# Altium schematic sheet MCU.SchDoc
size A3
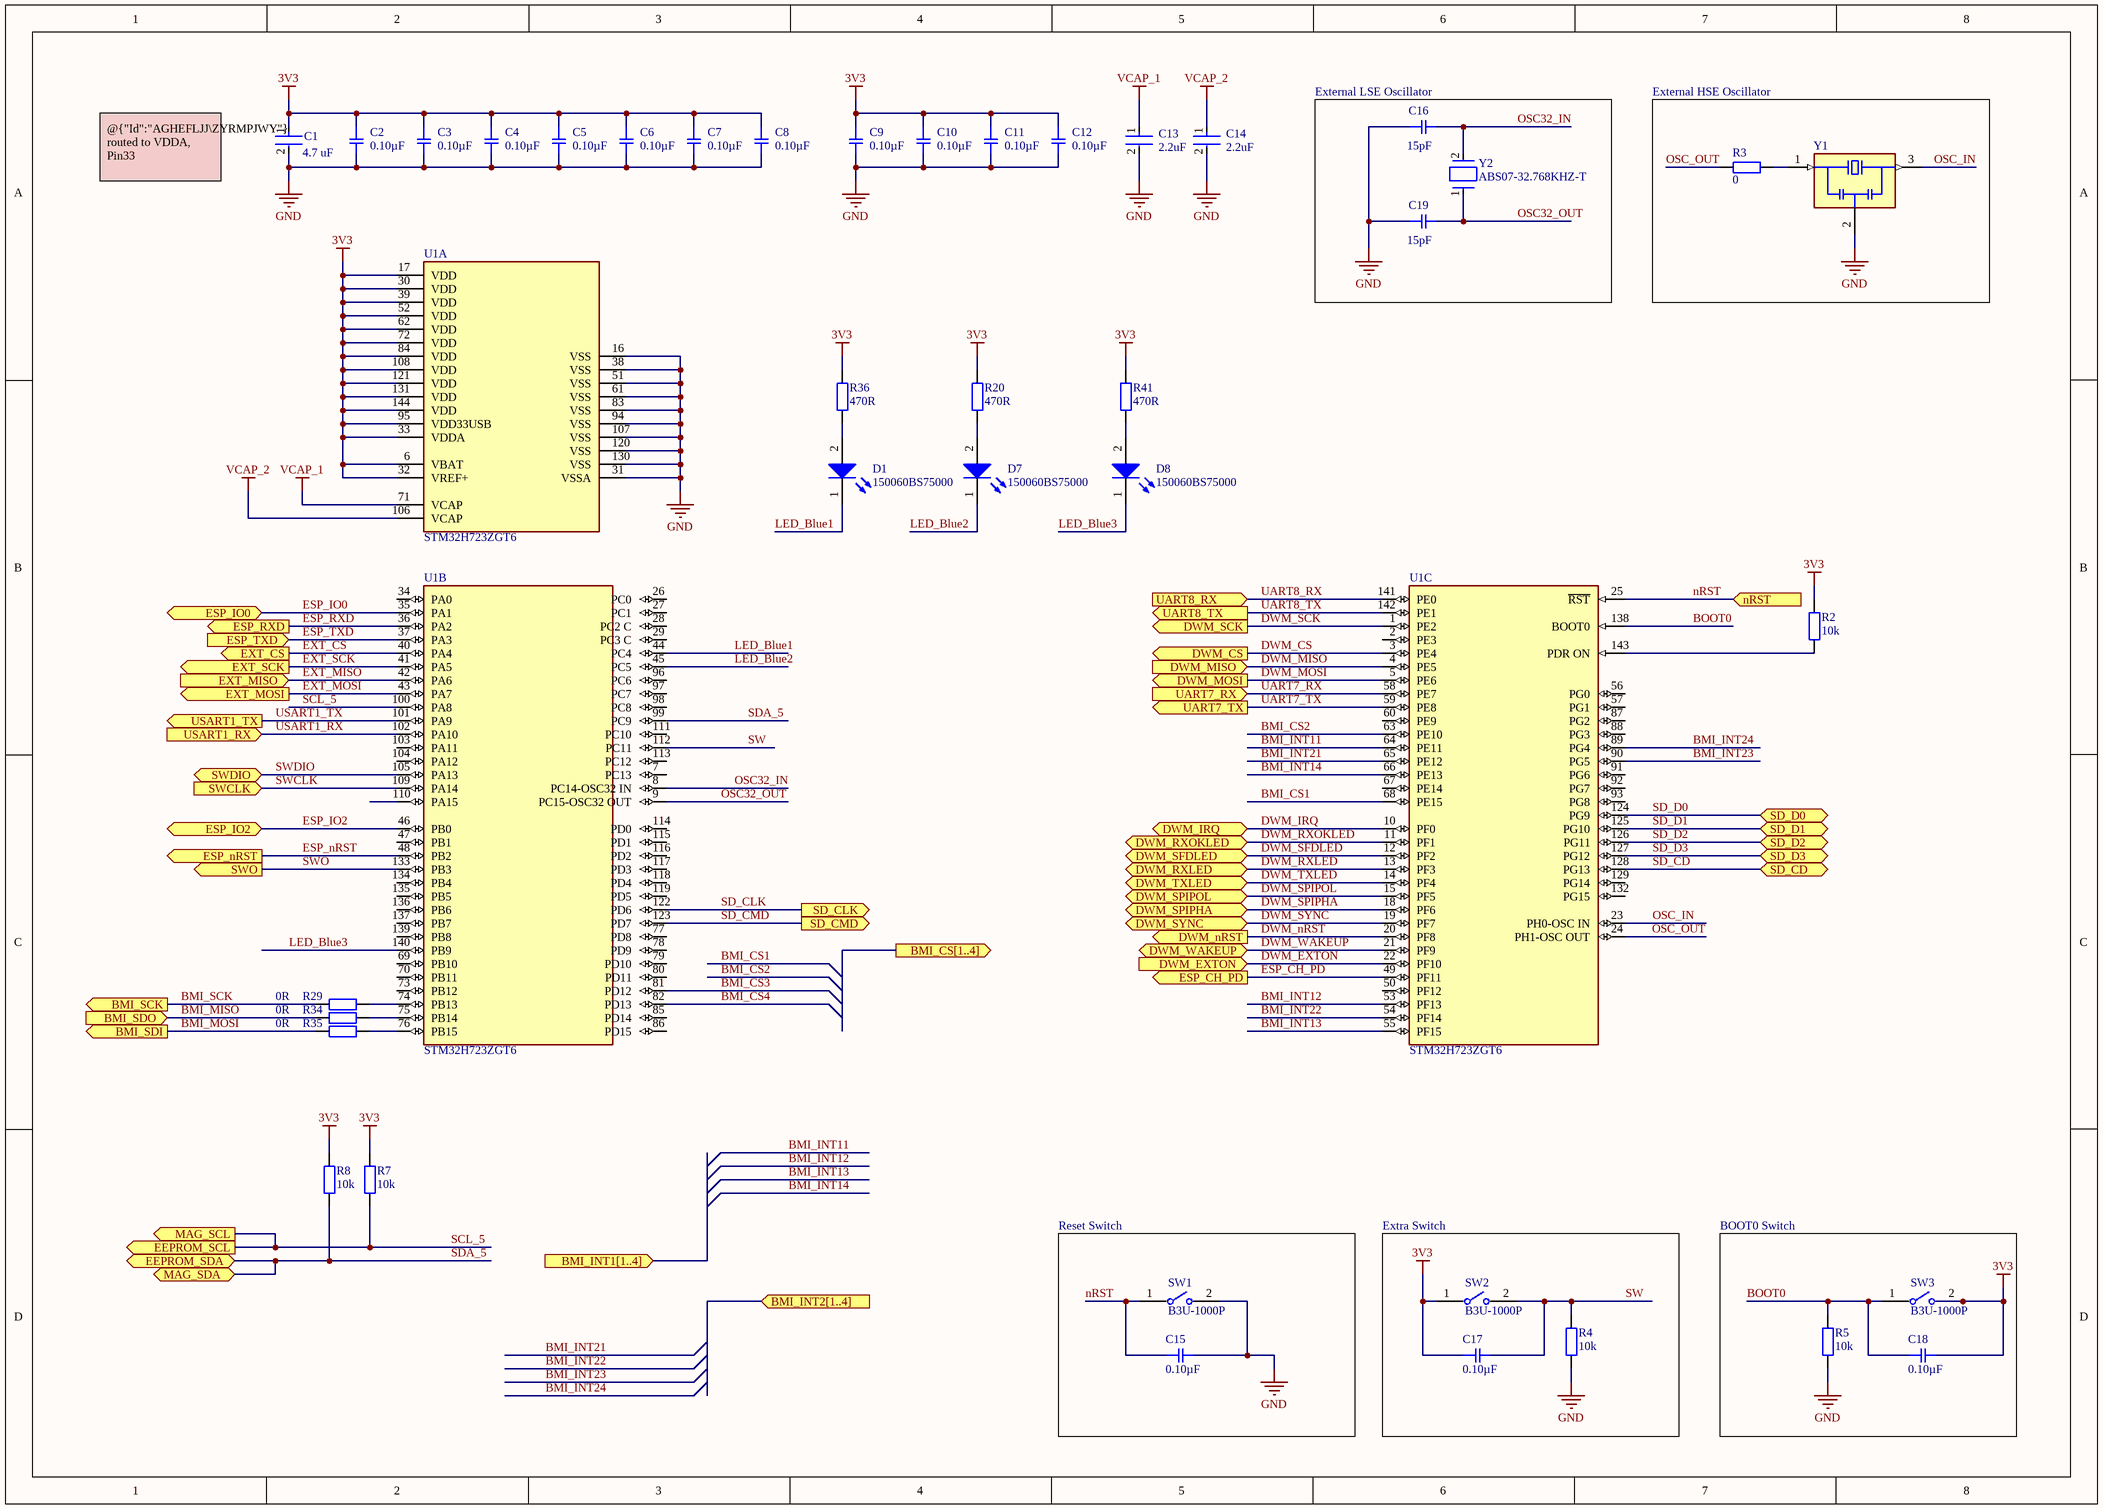
[diagram p0: MCU.SchDoc]

## Parts
C1  value 4.7 uF  [FP-CC0805-0_85-MFG]  (hidden comment: CC0805KKX7R8BB475)
C2  value 0.10µF  [SMD-0402C]  (hidden comment: GRM155R61A104KA01J)
C3  value 0.10µF  [SMD-0402C]  (hidden comment: GRM155R61A104KA01J)
C4  value 0.10µF  [SMD-0402C]  (hidden comment: GRM155R61A104KA01J)
C5  value 0.10µF  [SMD-0402C]  (hidden comment: GRM155R61A104KA01J)
C6  value 0.10µF  [SMD-0402C]  (hidden comment: GRM155R61A104KA01J)
C7  value 0.10µF  [SMD-0402C]  (hidden comment: GRM155R61A104KA01J)
C8  value 0.10µF  [SMD-0402C]  (hidden comment: GRM155R61A104KA01J)
C9  value 0.10µF  [SMD-0402C]  (hidden comment: GRM155R61A104KA01J)
C10  value 0.10µF  [SMD-0402C]  (hidden comment: GRM155R61A104KA01J)
C11  value 0.10µF  [SMD-0402C]  (hidden comment: GRM155R61A104KA01J)
C12  value 0.10µF  [SMD-0402C]  (hidden comment: GRM155R61A104KA01J)
C13  Capacitance: 2.2uF  [FP-GRM21B-0_15-IPC_A]  (hidden comment: GRM21BR71E225KE11L)
C14  Capacitance: 2.2uF  [FP-GRM21B-0_15-IPC_A]  (hidden comment: GRM21BR71E225KE11L)
C15  value 0.10µF  [SMD-0402C]  (hidden comment: GRM155R61A104KA01J)
C16  value 15pF  [SMD-0402C]  (hidden comment: GRM1555C1H150FA01D)
C17  value 0.10µF  [SMD-0402C]  (hidden comment: GRM155R61A104KA01J)
C18  value 0.10µF  [SMD-0402C]  (hidden comment: GRM155R61A104KA01J)
C19  value 15pF  [SMD-0402C]  (hidden comment: GRM1555C1H150FA01D)
D1  150060BS75000  [WL-SMCW_0603_150060xx75000]
D7  150060BS75000  [WL-SMCW_0603_150060xx75000]
D8  150060BS75000  [WL-SMCW_0603_150060xx75000]
R2  10k  [IPC C R0402 NO SILK]
R3  value 0  [IPC C R0402 NO SILK]  (hidden comment: 0R)
R4  10k  [IPC C R0402 NO SILK]
R5  10k  [IPC C R0402 NO SILK]
R7  10k  [IPC C R0402 NO SILK]
R8  10k  [IPC C R0402 NO SILK]
R20  470R  [IPC C R0402 NO SILK]
R29  0R  [IPC C R0402 NO SILK]
R34  0R  [IPC C R0402 NO SILK]
R35  0R  [IPC C R0402 NO SILK]
R36  470R  [IPC C R0402 NO SILK]
R41  470R  [IPC C R0402 NO SILK]
SW1  B3U-1000P  [FP-B3U-1000P-MFG]
SW2  B3U-1000P  [FP-B3U-1000P-MFG]
SW3  B3U-1000P  [FP-B3U-1000P-MFG]
U1  STM32H723ZGT6  [FP-LQFP144-1A-IPC_A]  (parts A,B,C of 3)
Y1  CSTNE8M00G550000R0  [OSC_CSTNE8M00G550000R0]  (value not drawn)
Y2  ABS07-32.768KHZ-T  [FP-ABS07-MFG]

## Blocks framed on the sheet
External LSE Oscillator: C16 C19 Y2
External HSE Oscillator: R3 Y1
Reset Switch: C15 SW1
Extra Switch: C17 R4 SW2
BOOT0 Switch: C18 R5 SW3

## Ports
BMI_CS[1..4] (out), BMI_INT1[1..4] (in), BMI_INT2[1..4] (in), BMI_SCK (out), BMI_SDI (out), BMI_SDO (in), DWM_CS (out), DWM_EXTON (in), DWM_IRQ (bidir), DWM_MISO (in), DWM_MOSI (out), DWM_nRST (out), DWM_RXLED (bidir), DWM_RXOKLED (bidir), DWM_SCK (out), DWM_SFDLED (bidir), DWM_SPIPHA (bidir), DWM_SPIPOL (bidir), DWM_SYNC (bidir), DWM_TXLED (bidir), DWM_WAKEUP (bidir), EEPROM_SCL (out), EEPROM_SDA (bidir), ESP_CH_PD (out), ESP_IO0 (bidir), ESP_IO2 (bidir), ESP_nRST (out), ESP_RXD (out), ESP_TXD (in), EXT_CS (out), EXT_MISO (in), EXT_MOSI (out), EXT_SCK (out), MAG_SCL (out), MAG_SDA (bidir), nRST (in), SD_CD (bidir), SD_CLK (out), SD_CMD (out), SD_D0 (bidir), SD_D1 (bidir), SD_D2 (bidir), SD_D3 (bidir), SWCLK (in), SWDIO (bidir), SWO (out), UART7_RX (in), UART7_TX (out), UART8_RX (in), UART8_TX (out), USART1_RX (in), USART1_TX (out)

## Nets
3V3: C1.1 C2.1 C3.1 C4.1 C5.1 C6.1 C7.1 C8.1 C9.1 C10.1 C11.1 C12.1 C17.1 C18.2 R2.1 R7.1 R8.1 R20.2 R36.2 R41.2 SW2.1 SW3.2 U1.6(VBAT) U1.17(VDD) U1.30(VDD) U1.32(VREF+) U1.33(VDDA) U1.39(VDD) U1.52(VDD) U1.62(VDD) U1.72(VDD) U1.84(VDD) U1.95(VDD33USB) U1.108(VDD) U1.121(VDD) U1.131(VDD) U1.144(VDD)
GND: C1.2 C2.2 C3.2 C4.2 C5.2 C6.2 C7.2 C8.2 C9.2 C10.2 C11.2 C12.2 C13.2 C14.2 C15.2 C16.1 C19.1 R4.1 R5.1 SW1.2 U1.16(VSS) U1.31(VSSA) U1.38(VSS) U1.51(VSS) U1.61(VSS) U1.83(VSS) U1.94(VSS) U1.107(VSS) U1.120(VSS) U1.130(VSS) Y1.2(GND)
VCAP_1: C13.1 U1.71(VCAP)
VCAP_2: C14.1 U1.106(VCAP)
BMI_CS1: U1.68(PE15)
BMI_CS2: U1.63(PE10)
BMI_CS3: U1.81(PD12)
BMI_CS4: U1.82(PD13)
BMI_INT11: U1.64(PE11)
BMI_INT12: U1.53(PF13)
BMI_INT13: U1.55(PF15)
BMI_INT14: U1.66(PE13)
BMI_INT21: U1.65(PE12)
BMI_INT22: U1.54(PF14)
BMI_INT23: U1.90(PG5)
BMI_INT24: U1.89(PG4)
BMI_MISO: R34.1 ; port BMI_SDO
BMI_MOSI: R35.1 ; port BMI_SDI
BMI_SCK: R29.1 ; port BMI_SCK
BOOT0: C18.1 R5.2 SW3.1 U1.138(BOOT0)
DWM_CS: U1.3(PE4) ; port DWM_CS
DWM_EXTON: U1.22(PF10) ; port DWM_EXTON
DWM_IRQ: U1.10(PF0) ; port DWM_IRQ
DWM_MISO: U1.4(PE5) ; port DWM_MISO
DWM_MOSI: U1.5(PE6) ; port DWM_MOSI
DWM_nRST: U1.20(PF8) ; port DWM_nRST
DWM_RXLED: U1.13(PF3) ; port DWM_RXLED
DWM_RXOKLED: U1.11(PF1) ; port DWM_RXOKLED
DWM_SCK: U1.1(PE2) ; port DWM_SCK
DWM_SFDLED: U1.12(PF2) ; port DWM_SFDLED
DWM_SPIPHA: U1.18(PF6) ; port DWM_SPIPHA
DWM_SPIPOL: U1.15(PF5) ; port DWM_SPIPOL
DWM_SYNC: U1.19(PF7) ; port DWM_SYNC
DWM_TXLED: U1.14(PF4) ; port DWM_TXLED
DWM_WAKEUP: U1.21(PF9) ; port DWM_WAKEUP
ESP_CH_PD: U1.49(PF11) ; port ESP_CH_PD
ESP_IO0: U1.35(PA1) ; port ESP_IO0
ESP_IO2: U1.46(PB0) ; port ESP_IO2
ESP_nRST: U1.48(PB2) ; port ESP_nRST
ESP_RXD: U1.36(PA2) ; port ESP_RXD
ESP_TXD: U1.37(PA3) ; port ESP_TXD
EXT_CS: U1.40(PA4) ; port EXT_CS
EXT_MISO: U1.42(PA6) ; port EXT_MISO
EXT_MOSI: U1.43(PA7) ; port EXT_MOSI
EXT_SCK: U1.41(PA5) ; port EXT_SCK
LED_Blue1: D1.1(K) U1.44(PC4)
LED_Blue2: D7.1(K) U1.45(PC5)
LED_Blue3: D8.1(K) U1.140(PB9)
nRST: C15.1 SW1.1 U1.25(~{RST}) ; port nRST
OSC32_IN: C16.2 U1.8(PC14-OSC32_IN) Y2.2
OSC32_OUT: C19.2 U1.9(PC15-OSC32_OUT) Y2.1
OSC_IN: U1.23(PH0-OSC_IN) Y1.3(OUT)
OSC_OUT: R3.2 U1.24(PH1-OSC_OUT)
SCL_5: R7.2 U1.100(PA8) ; port EEPROM_SCL, port MAG_SCL
SD_CD: U1.128(PG13) ; port SD_CD
SD_CLK: U1.122(PD6) ; port SD_CLK
SD_CMD: U1.123(PD7) ; port SD_CMD
SD_D0: U1.124(PG9) ; port SD_D0
SD_D1: U1.125(PG10) ; port SD_D1
SD_D2: U1.126(PG11) ; port SD_D2
SD_D3: U1.127(PG12) ; port SD_D3
SDA_5: R8.2 U1.99(PC9) ; port EEPROM_SDA, port MAG_SDA
SW: C17.2 R4.2 SW2.2 U1.112(PC11)
SWCLK: U1.109(PA14) ; port SWCLK
SWDIO: U1.105(PA13) ; port SWDIO
SWO: U1.133(PB3) ; port SWO
UART7_RX: U1.58(PE7) ; port UART7_RX
UART7_TX: U1.59(PE8) ; port UART7_TX
UART8_RX: U1.141(PE0) ; port UART8_RX
UART8_TX: U1.142(PE1) ; port UART8_TX
USART1_RX: U1.102(PA10) ; port USART1_RX
USART1_TX: U1.101(PA9) ; port USART1_TX
NetD1_2: D1.2(A) R36.1
NetD7_2: D7.2(A) R20.1
NetD8_2: D8.2(A) R41.1
NetR2_2: R2.2 U1.143(PDR_ON)
NetR3_1: R3.1 Y1.1(IN)
NetR29_2: R29.2 U1.74(PB13)
NetR34_2: R34.2 U1.75(PB14)
NetR35_2: R35.2 U1.76(PB15)

Not connected (* = marked no-connect by the designer): U1 2(PE3) 7(PC13) 26(PC0) 27(PC1) 28(PC2_C) 29(PC3_C) 34(PA0) 47(PB1) 50(PF12) 56(PG0) 57(PG1) 60(PE9) 67(PE14) 69(PB10) 70(PB11) 73(PB12) 77(PD8) 78(PD9) 79(PD10) 80(PD11) 85(PD14) 86(PD15) 87(PG2) 88(PG3) 91(PG6) 92(PG7) 93(PG8) 96(PC6) 97(PC7) 98(PC8) 103(PA11) 104(PA12) 110(PA15) 111(PC10) 113(PC12) 114(PD0) 115(PD1) 116(PD2) 117(PD3) 118(PD4) 119(PD5) 129(PG14) 132(PG15) 134(PB4) 135(PB5) 136(PB6) 137(PB7) 139(PB8)

## Notes on the sheet
- @{"Id":"AGHEFLJJ\ZYRMPJWY"} routed to VDDA, Pin33

## Library data of the parts
C1 = CMP-03422-000306-1: CAP CER 4.7UF 25V X7R 0805; Manufacturer: Yageo; Material: Ceramic; Tolerance: 0.1; ComponentLink2Description: Datasheet; Footprint Url: http://www.yageo.com/exep/pages/download/literatures/UPY-C_GEN_24.pdf; Temperature Range High: +85°C; Package: CC0805-0.85; Octopart: https://octopart.com/cc0805kkx7r8bb475-yageo-51849247; Mouser Description: Multilayer Ceramic Capacitors MLCC - SMD/SMT 4.7M pF 10% 25 Volts; Capacitance: 4.7 uF; Ipc Land Pattern Name: CAPC200125X85; Temperature: -30°C to +85°C; Digikey Description: CAP CER 4.7UF 25V X7R 0805; Temperature Characteristic: X7R; Temperature Range Low: -30°C; Lead Free: Yes; RoHS: TRUE; Device Class L3: Ceramic Capacitors; ComponentLink2URL: http://www.yageo.com/documents/recent/UPY-GPHC_Y5V_6.3V-to-50V_8.pdf; Category: Cap; Device Class L2: Capacitors; Manufacturer Part Number: CC0805KKX7R8BB475; Device Class L1: Passive Components; Height: 0.95mm; Automotive: No; Voltage Rating: 25 V
C2-C12 C15 C17 C18 = CMP-140-000687-1: CAP CER 0.1UF 10V X5R 0402; Manufacturer: Murata Electronics North America; Factory Stock: 0; Unit Price (USD): 0.1; Minimum Quantity: 1; Tolerance: ±10%; Ratings: -; Lead Spacing: -; Source: capacitor_murata_0402$.SchLib; Part Status: Active; Pin Count: 2; Digi-Key Part Number: 490-6297-1-ND; Operating Temperature: -55°C ~ 85°C; Height - Seated (Max): -; Voltage: 10V; @ qty: 0; Temperature Coefficient: X5R; Package / Case: 0402 (1005 Metric); Size / Dimension: 0.039" L x 0.020" W (1.00mm x 0.50mm); Quantity Available: 24406; Datasheets: http://www.murata.com/~/media/webrenewal/support/library/catalog/products/capacitor/mlcc/c02e.pdf; Series: GRM; Applications: General Purpose; Thickness (Max): 0.022" (0.55mm); Image: //media.digikey.com/Renders/Murata%20Renders/ZRB-SERIES-0402.jpg; Packaging: Cut Tape (CT); Part Number: GRM155R61A104KA01J; Features: -; Component Type: Standard; Mounting Type: Surface Mount, MLCC; Design Item ID: GRM155R61A104KA01J
C13 C14 = CMP-06035-028354-1: Chip Multilayer Ceramic Capacitors for General Purpose, 0805, 2.2uF, X7R, 15%, 10%, 25V; Voltage Rating (DC): 25V; Thickness: 1.25mm; Dielectric: X7R; Tolerance: 10%; Length: 2mm; Width: 1.25mm
C16 C19 = CMP-140-000297-1: CAP CER 15PF 50V NP0 0402; Manufacturer: Murata Electronics North America; Minimum Quantity: 1; Factory Stock: 0; Tolerance: ±1%; Unit Price (USD): 0.1; Temperature Coefficient: C0G, NP0; Component Type: Standard; Features: -; Part Status: Active; Thickness (Max): 0.022" (0.55mm); Quantity Available: 187310; Design Item ID: GRM1555C1H150FA01D; Datasheets: http://www.murata.com/~/media/webrenewal/support/library/catalog/products/capacitor/mlcc/c02e.pdf; Image: //media.digikey.com/Renders/Murata%20Renders/ZRB-SERIES-0402.jpg; Applications: General Purpose; Packaging: Cut Tape (CT); Height - Seated (Max): -; Source: capacitor_murata_0402$.SchLib; Ratings: -; Lead Style: -; Voltage: 50V; Lead Spacing: -; Pin Count: 2; Mounting Type: Surface Mount, MLCC; Digi-Key Part Number: 490-6200-1-ND; Size / Dimension: 0.039" L x 0.020" W (1.00mm x 0.50mm); Package / Case: 0402 (1005 Metric); Operating Temperature: -55°C ~ 125°C; Series: GRM; Part Number: GRM1555C1H150FA01D; @ qty: 0
D1 D7 D8 = CMP-1426-00003-4: Led, Blue, 470 Nm, 3.2 V, 30 Ma, 145 Mcd Rohs Compliant: Yes; Peak Wavelength: 465nm; Dominant Wavelength: 470nm; Power Dissipation: 105mW; Viewing Angle: 140°; Test Current: 20mA; Max Junction Temperature (Tj): 95°C; Forward Current: 100mA; Reverse Voltage: 5V; Luminous Intensity: 145mcd; Lens Style: Clear, Rectangular; Forward Voltage: 3.2V; RoHS: Compliant; Min Operating Temperature: -40°C; REACH SVHC: Unknown; Max Operating Temperature: 85°C; Width: 800µm; Case Code (Imperial): 0603; Case Code (Metric): 1608; Max Reverse Voltage (DC): 5V; Height: 700µm; Case/Package: 0603; Mount: Surface Mount; Packaging: Tape and Reel; Color: Blue; Wavelength: 470nm; Length: 1.6mm
R2-R5 R7 R8 R20 R29 R34-R36 R41 = CMP-009-00183-1: Design Item ID: Generic RES 0402; Source: Schlib1.SchLib
  R2 R4 R5 R7 R8: Value: 10k
  R20 R36 R41: Value: 470R
  R29 R34 R35: Value: 0R
SW1-SW3 = CMP-2100-03586-2: SWITCH TACTILE SPST-NO 0.05A 12V; Contact Resistance: 100mR; Operating Force: 1.5N; Max Current Rating: 50mA; Switch Travel: 0.15mm; Actuator Type: Standard; Mechanical Life: 200000Cycles; Ratings: Dust Proof; Illumination Type: Non-Illuminated; Throw Configuration: SPST; Actuator Length: 0.4mm; Switch Function: Off-Mom; Height: 1.2mm; Width: 3mm; Weight: 0.000776oz; Contact Material: Silver; Max Voltage Rating (DC): 12V; Insulation Resistance: 100MR; Lead Free: Lead Free; Current Rating: 50mA; Termination: SMD/SMT; Length: 4mm; Voltage Rating (DC): 12V; Contact Current Rating: 50mA; Orientation: Straight; Depth: 2.5mm; Max Operating Temperature: 70°C; Packaging: Tape and Reel; Min Operating Temperature: -25°C; Package Quantity: 1; Mount: Surface Mount; Electrical Life: 200000Cycles
U1 = CMP-12105-000148-1: IC MCU 32BIT 1MB FLASH 144LQFP
Y1 = CMP-001-00084-2: 8 MHz Ceramic Resonator Built in Capacitor 33 pF Â±0.2% 40 Ohms -40Â°C ~ 85Â°C Surface Mount; MF: Murata Electronics; Check_prices: https://www.snapeda.com/parts/CSTNE8M00G550000R0/Murata+Electronics+North+America/view-part/?ref=eda; Case/Package: SMD-3 Murata; Source: CSTNE8M00G550000R0.SchLib; SnapEDA_Link: https://www.snapeda.com/parts/CSTNE8M00G550000R0/Murata+Electronics+North+America/view-part/?ref=snap; MP: CSTNE8M00G550000R0; Design Item ID: CSTNE8M00G550000R0; Component Type: Standard; Pins: 3
Y2 = CMP-0447-00001-4: Crystal 32.768kHz ±20ppm (Tol) 12.5pF FUND 70kΩ 2-Pin CSMD T/R; ESR (Equivalent Series Resistance): 70kR; Radiation Hardening: No; Frequency: 32.768kHz; Length: 3.2mm; Max Operating Temperature: 85°C; Number of Pins: 2; Series: ABS07; Min Operating Temperature: -40°C; Frequency Tolerance: 20ppm; Packaging: Tape and Reel; Height: 0.9mm; Width: 1.5mm; Depth: 1.5mm; Load Capacitance: 12.5pF; RoHS Compliant: Yes; Tolerance: 20ppm; Termination: SMD/SMT; Lead Free: Lead Free; Series Resistance: 70kR; REACH SVHC: No SVHC; Case/Package: CSMD; Operating Frequency: 32.768 kHz; Package Quantity: 3000